# Altium schematic sheet IMU.SchDoc
size A
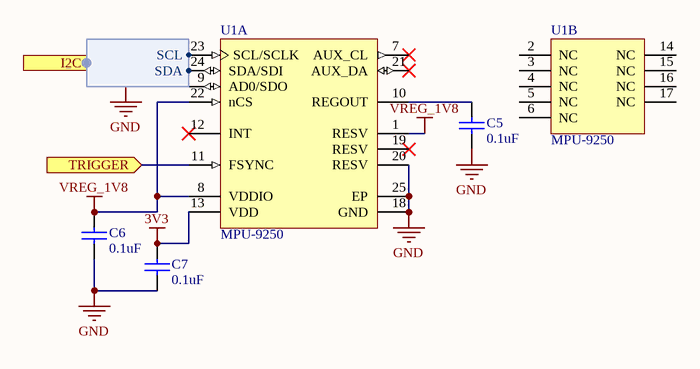
[diagram p0: IMU.SchDoc]

## Parts
C5  value 0.1uF  [C0402[1005X55]]  (hidden comment: 0.1uF 6.3V 0402)
C6  value 0.1uF  [C0402[1005X55]]  (hidden comment: 0.1uF 6.3V 0402)
C7  value 0.1uF  [C0402[1005X55]]  (hidden comment: 0.1uF 6.3V 0402)
U1  MPU-9250  [QFN-24 (0.4MM)]  (parts A,B of 2)

## Ports
I2C (harness I2C), TRIGGER (in)

## Harnesses
I2C: SCL, SDA

## Nets
3V3: C7.2 U1.13(VDD)
GND: C5.1 C6.1 C7.1 U1.9(AD0/SDO) U1.18(GND) U1.20(RESV) U1.25(EP)
VREG_1V8: C6.2 U1.1(RESV) U1.8(VDDIO) U1.22(nCS)
TRIGGER: U1.11(FSYNC) ; port TRIGGER
NetC5_2: C5.2 U1.10(REGOUT)
NetU1_23: U1.23(SCL/SCLK) ; port I2C.SCL
NetU1_24: U1.24(SDA/SDI) ; port I2C.SDA

Not connected (* = marked no-connect by the designer): U1 2(NC) 3(NC) 4(NC) 5(NC) 6(NC) 7(AUX_CL)* 12(INT)* 14(NC) 15(NC) 16(NC) 17(NC) 19(RESV)* 21(AUX_DA)*

## Library data of the parts
C5-C7 = CAP_0.1uF_6.3V_0402_10%: 0.1uF 6.3V 10% 0402 (1005 Metric); PartNumber: GRM155R70J104KA01D; Manufacturer: Murata; Mounting Technology: Surface Mount; PackageReference: 0402; PackageDescription: 0402 (1005 Metric); Voltage: 6.3V; Tolerance: 10%
U1 = MPU-9250: Manufacturer: Invensense; PartNumber: MPU-9250; Mounting Technology: Surface Mount; PackageReference: QFN-24